# Altium schematic sheet TOP.SchDoc
size A4
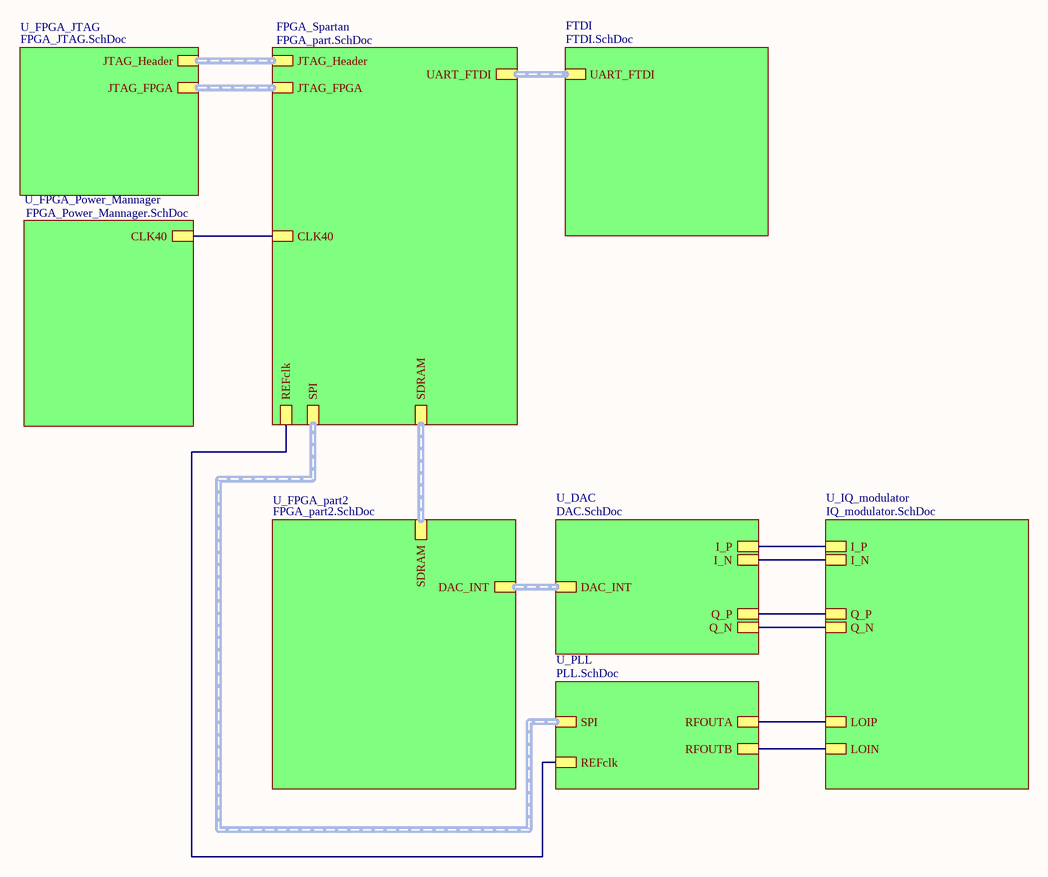
[diagram p0: TOP.SchDoc]

## Sub-sheets
FPGA_Spartan = FPGA_part.SchDoc: JTAG_FPGA (harness JTAG_FPGA), JTAG_Header (harness JTAG_Header), CLK40, UART_FTDI (harness UART), SDRAM (harness SDRAM), REFclk, SPI (harness SPI)
FTDI = FTDI.SchDoc: UART_FTDI (harness UART)
U_DAC = DAC.SchDoc: DAC_INT (harness DAC), I_P, I_N, Q_P, Q_N
U_FPGA_JTAG = FPGA_JTAG.SchDoc: JTAG_FPGA (harness JTAG_FPGA), JTAG_Header (harness JTAG_Header)
U_FPGA_part2 = FPGA_part2.SchDoc: DAC_INT (harness DAC), SDRAM (harness SDRAM)
U_FPGA_Power_Mannager = FPGA_Power_Mannager.SchDoc: CLK40
U_IQ_modulator = IQ_modulator.SchDoc: Q_N, Q_P, I_N, I_P, LOIP, LOIN
U_PLL = PLL.SchDoc: SPI (harness SPI), REFclk, RFOUTA, RFOUTB

## Nets
(unnamed): sheet FPGA_Spartan/CLK40, sheet U_FPGA_Power_Mannager/CLK40
(unnamed): sheet FPGA_Spartan/REFclk, sheet U_PLL/REFclk
(unnamed): sheet U_DAC/I_P, sheet U_IQ_modulator/I_P
(unnamed): sheet U_DAC/I_N, sheet U_IQ_modulator/I_N
(unnamed): sheet U_DAC/Q_P, sheet U_IQ_modulator/Q_P
(unnamed): sheet U_DAC/Q_N, sheet U_IQ_modulator/Q_N
(unnamed): sheet U_PLL/RFOUTA, sheet U_IQ_modulator/LOIP
(unnamed): sheet U_PLL/RFOUTB, sheet U_IQ_modulator/LOIN

## Buses and harness runs
harness sheet FPGA_Spartan/JTAG_FPGA = sheet U_FPGA_JTAG/JTAG_FPGA
harness sheet FPGA_Spartan/JTAG_Header = sheet U_FPGA_JTAG/JTAG_Header
harness sheet FPGA_Spartan/SDRAM = sheet U_FPGA_part2/SDRAM
harness sheet FPGA_Spartan/SPI = sheet U_PLL/SPI
harness sheet FPGA_Spartan/UART_FTDI = sheet FTDI/UART_FTDI
harness sheet U_DAC/DAC_INT = sheet U_FPGA_part2/DAC_INT